# Altium schematic sheet [2] BLOCK DIAGRAM.SchDoc
size 300 x 200 mm
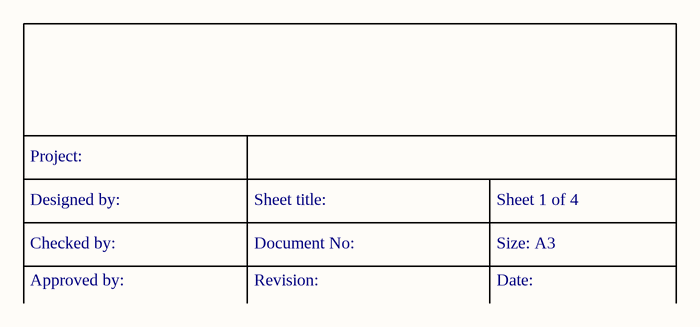
[diagram p0: [2] BLOCK DIAGRAM.SchDoc]

## Notes on the sheet
- Project:
- Designed by:
- Sheet title:
- Sheet 1 of 4
- Approved by:
- Checked by:
- Document No:
- Revision:
- Size: A3
- Date: